# Altium schematic sheet IsolatedPeltierDriver.SchDoc
size A4
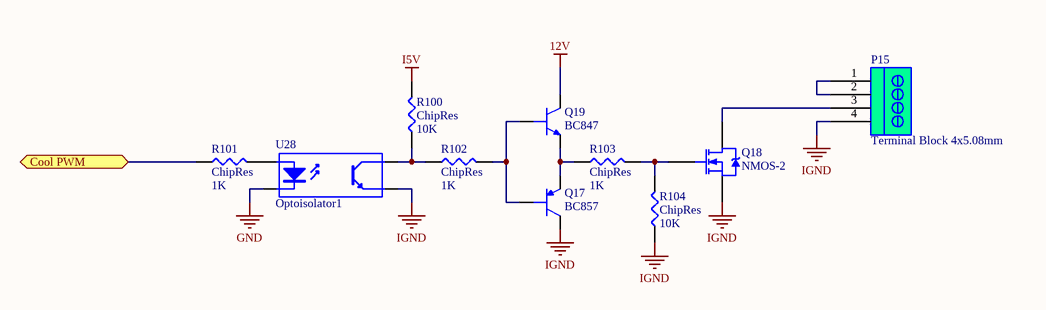
[diagram p0: IsolatedPeltierDriver.SchDoc]

## Parts
P15  Terminal Block 4x5.08mm  [Socket 4x5.08]
Q17  BC857  [SOT23]
Q18  NMOS-2  [TO-220]
Q19  BC847  [SOT23]
R100  ChipRes  value 10K  [RES0805]
R101  ChipRes  value 1K  [RES0805]
R102  ChipRes  value 1K  [RES0805]
R103  ChipRes  value 1K  [RES0805]
R104  ChipRes  value 10K  [RES0805]
U28  Optoisolator1  [DIP-4]

## Ports
Cool PWM

## Nets
12V: Q19.3
GND: U28.2(K)
I5V: R100.2
IGND: P15.4 Q17.3 Q18.3(S) R104.1 U28.3(E)
Cool PWM: R101.1 ; port Cool PWM
NetP15_1: P15.1 P15.2
NetP15_3: P15.3 Q18.2(D)
NetQ17_1: Q17.1 Q19.1 R102.2
NetQ17_2: Q17.2 Q19.2 R103.1
NetQ18_1: Q18.1(G) R103.2 R104.2
NetR100_1: R100.1 R102.1 U28.4(C)
NetR101_2: R101.2 U28.1(A)

## Library data of the parts
P15 = Socket_4x5.08_RA_2Wall: Terminal Block Socket Right Angle 4x5.08mm 2-Wall
Q17 = BC857: PNP Transistor
Q18 = NMOS-2: N-Channel Power MOSFET; Note: Pin 2 is electrically connected to pin 4.; Published: 8-Jun-2000; LatestRevisionDate: 17-Jul-2002; LatestRevisionNote: Re-released for DXP Platform.; DatasheetVersion: PD-9.814; PackageVersion: Feb-1997; PackageReference: TO-220AB; Publisher: Altium Limited; PackageDescription: TO, Thru-Hole, Vertical, Heatsink Mounted; 3 In-Line Leads; Pitch 2.54 mm; ComponentLink1Description: Manufacturer Link; ComponentLink1URL: http://www.irf.com/
Q19 = BC847: NPN transistor
R100-R104 = ChipRes: Chip resistor
U28 = Optoisolator1: 4-Pin Phototransistor Optocoupler; Published: 24-Mar-1999; LatestRevisionDate: 04-Mar-2005; LatestRevisionNote: Sch pins 3 & 4 Swapped.; DatasheetVersion: Nov-2003; PackageReference: DIP-4; Publisher: Altium Limited